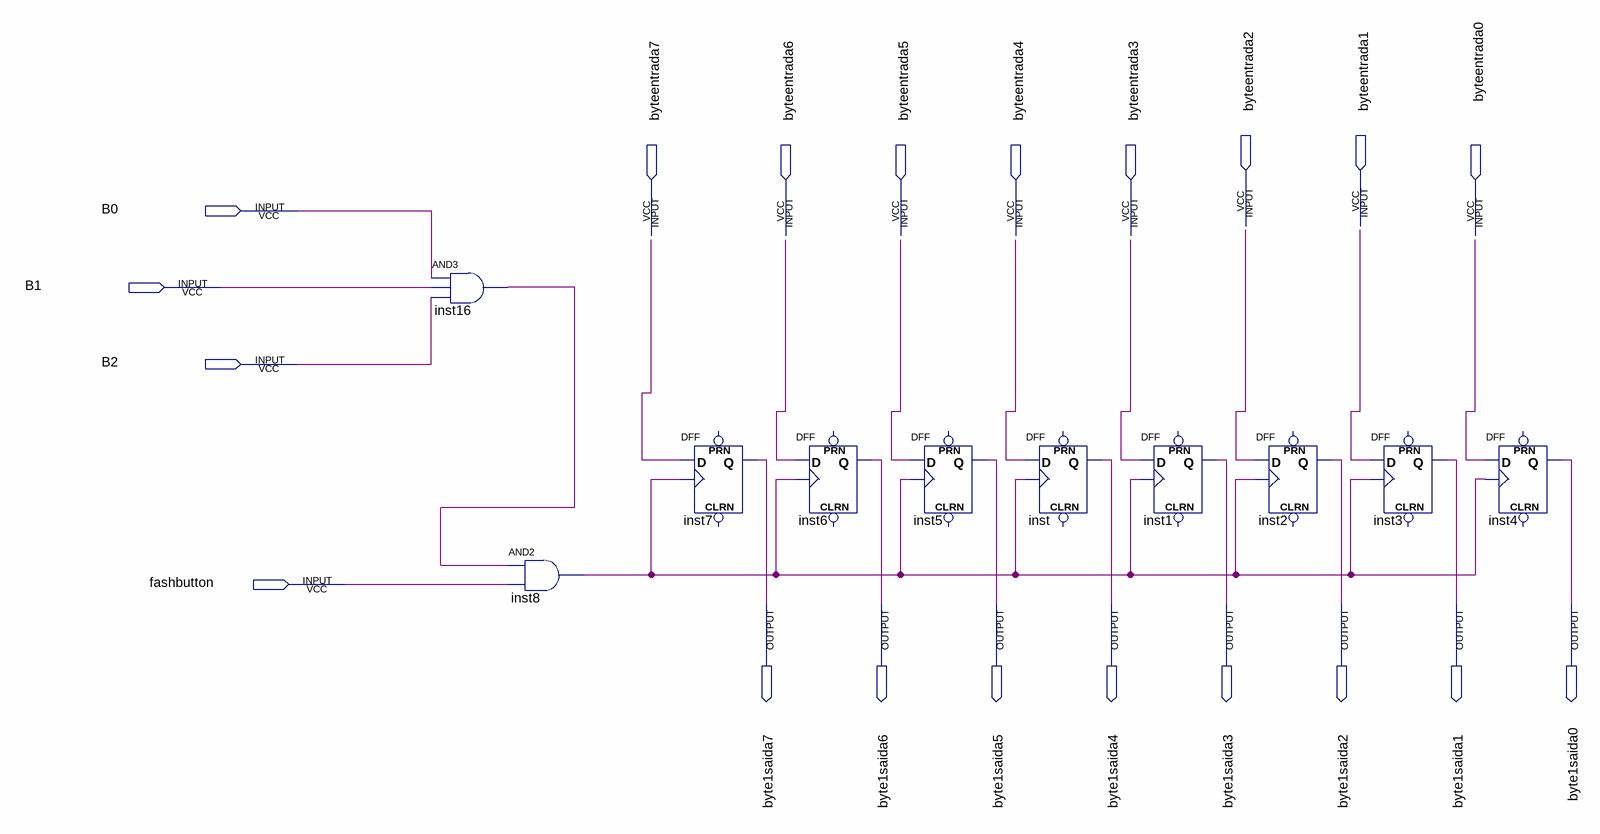
[diagram p0: schematic sheet]
// Quartus schematic PrimeiroByte.bdf as structural Verilog: 10 symbols, 20 pins
module PrimeiroByte (
  input  B0,
  input  byteentrada2,
  input  byteentrada1,
  input  byteentrada7,
  input  byteentrada6,
  input  byteentrada5,
  input  byteentrada4,
  input  byteentrada3,
  input  byteentrada0,
  input  B1,
  input  B2,
  input  fashbutton,
  output byte1saida7,
  output byte1saida6,
  output byte1saida5,
  output byte1saida4,
  output byte1saida3,
  output byte1saida2,
  output byte1saida1,
  output byte1saida0
);

  wire inst8_out, inst16_out;

  and inst16 (inst16_out, B0, B1, B2);
  and inst8 (inst8_out, inst16_out, fashbutton);
  DFF inst7 (.CLK(inst8_out), .D(byteentrada7), .Q(byte1saida7));  // open: CLRN, PRN
  DFF inst6 (.CLK(inst8_out), .D(byteentrada6), .Q(byte1saida6));  // open: CLRN, PRN
  DFF inst5 (.CLK(inst8_out), .D(byteentrada5), .Q(byte1saida5));  // open: CLRN, PRN
  DFF inst (.CLK(inst8_out), .D(byteentrada4), .Q(byte1saida4));  // open: CLRN, PRN
  DFF inst1 (.CLK(inst8_out), .D(byteentrada3), .Q(byte1saida3));  // open: CLRN, PRN
  DFF inst2 (.CLK(inst8_out), .D(byteentrada2), .Q(byte1saida2));  // open: CLRN, PRN
  DFF inst3 (.CLK(inst8_out), .D(byteentrada1), .Q(byte1saida1));  // open: CLRN, PRN
  DFF inst4 (.CLK(inst8_out), .D(byteentrada0), .Q(byte1saida0));  // open: CLRN, PRN
endmodule
